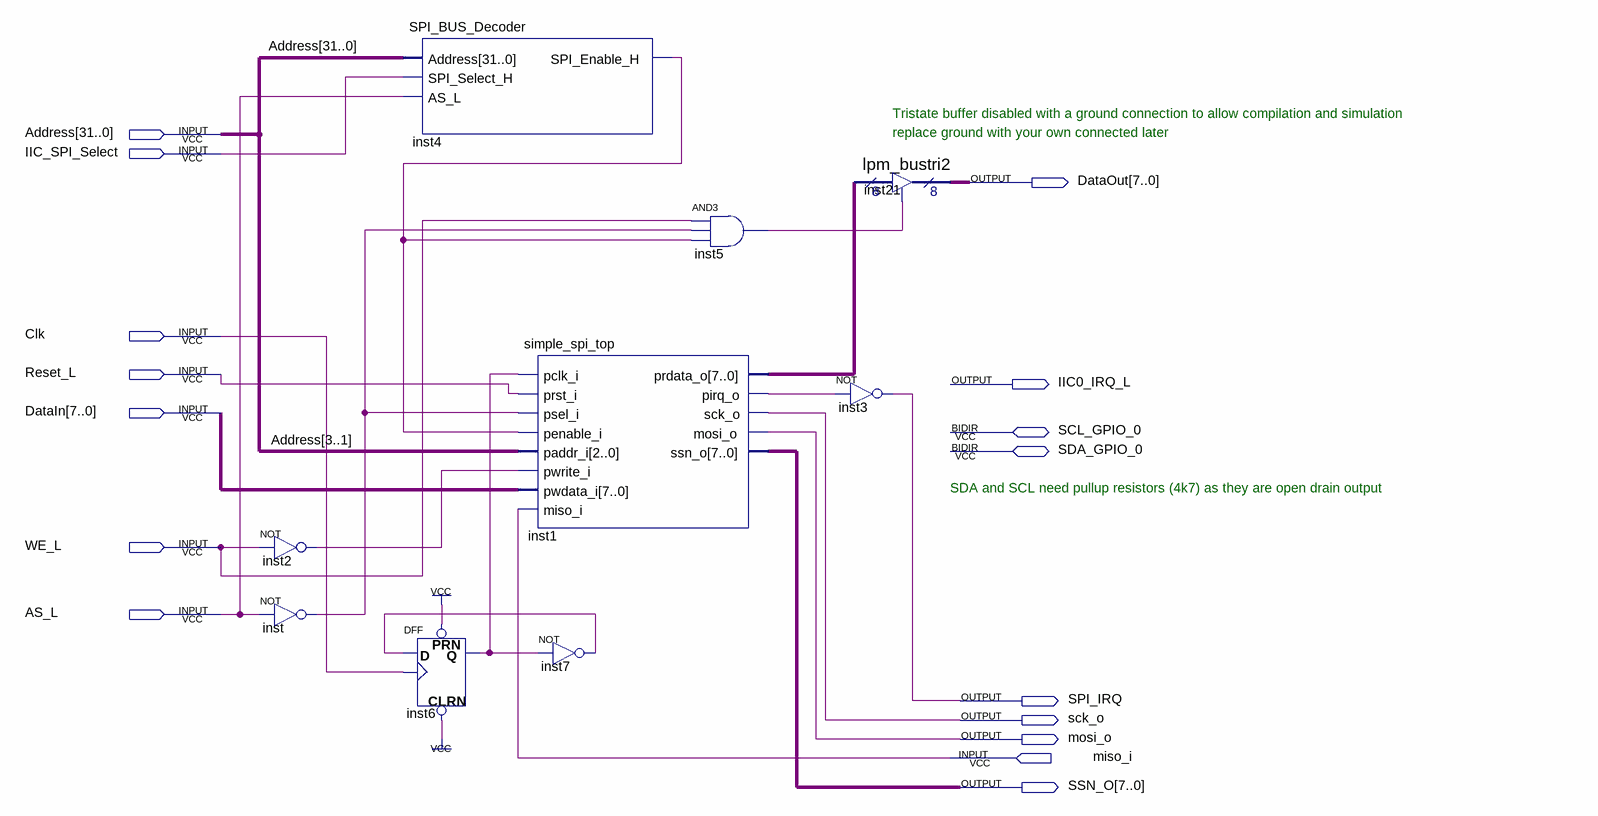
[diagram p0: schematic sheet]
// Quartus schematic IIC_SPI_Interface.bdf as structural Verilog: 9 symbols, 16 pins
module IIC_SPI_Interface (
  input  [31:0] Address,
  input  IIC_SPI_Select,
  input  Clk,
  input  Reset_L,
  input  [7:0] DataIn,
  input  WE_L,
  input  AS_L,
  input  miso_i,
  inout  SCL_GPIO_0,
  inout  SDA_GPIO_0,
  output [7:0] DataOut,
  output IIC0_IRQ_L,
  output SPI_IRQ,
  output sck_o,
  output mosi_o,
  output [7:0] SSN_O
);

  wire inst1_pirq_o, inst2_out, inst4_spi_enable_h, inst5_out, inst6_q, inst7_out, inst_out;
  wire [7:0] inst1_prdata_o;

  not inst2 (inst2_out, WE_L);
  not inst (inst_out, AS_L);
  SPI_BUS_Decoder inst4 (
    .Address(Address), .SPI_Select_H(IIC_SPI_Select), .AS_L(AS_L), .SPI_Enable_H(inst4_spi_enable_h));
  DFF inst6 (.CLRN(1'b1), .CLK(Clk), .D(inst7_out), .PRN(1'b1), .Q(inst6_q));
  simple_spi_top inst1 (
    .pclk_i(inst6_q), .prst_i(Reset_L), .psel_i(inst_out), .penable_i(inst4_spi_enable_h),
    .paddr_i(Address[3:1]), .pwrite_i(inst2_out), .pwdata_i(DataIn), .miso_i(miso_i),
    .prdata_o(inst1_prdata_o), .pirq_o(inst1_pirq_o), .sck_o(sck_o), .mosi_o(mosi_o), .ssn_o(SSN_O));
  not inst7 (inst7_out, inst6_q);
  and inst5 (inst5_out, WE_L, inst_out, inst4_spi_enable_h);
  lpm_bustri2 inst21 (.enabledt(inst5_out), .data(inst1_prdata_o), .tridata(DataOut));
  not inst3 (SPI_IRQ, inst1_pirq_o);

  // Notes on the sheet:
  //   Tristate buffer disabled with a ground connection to allow compilation and simulation
  //   replace ground with your own connected later
  //   SDA and SCL need pullup resistors (4k7) as they are open drain output
endmodule
